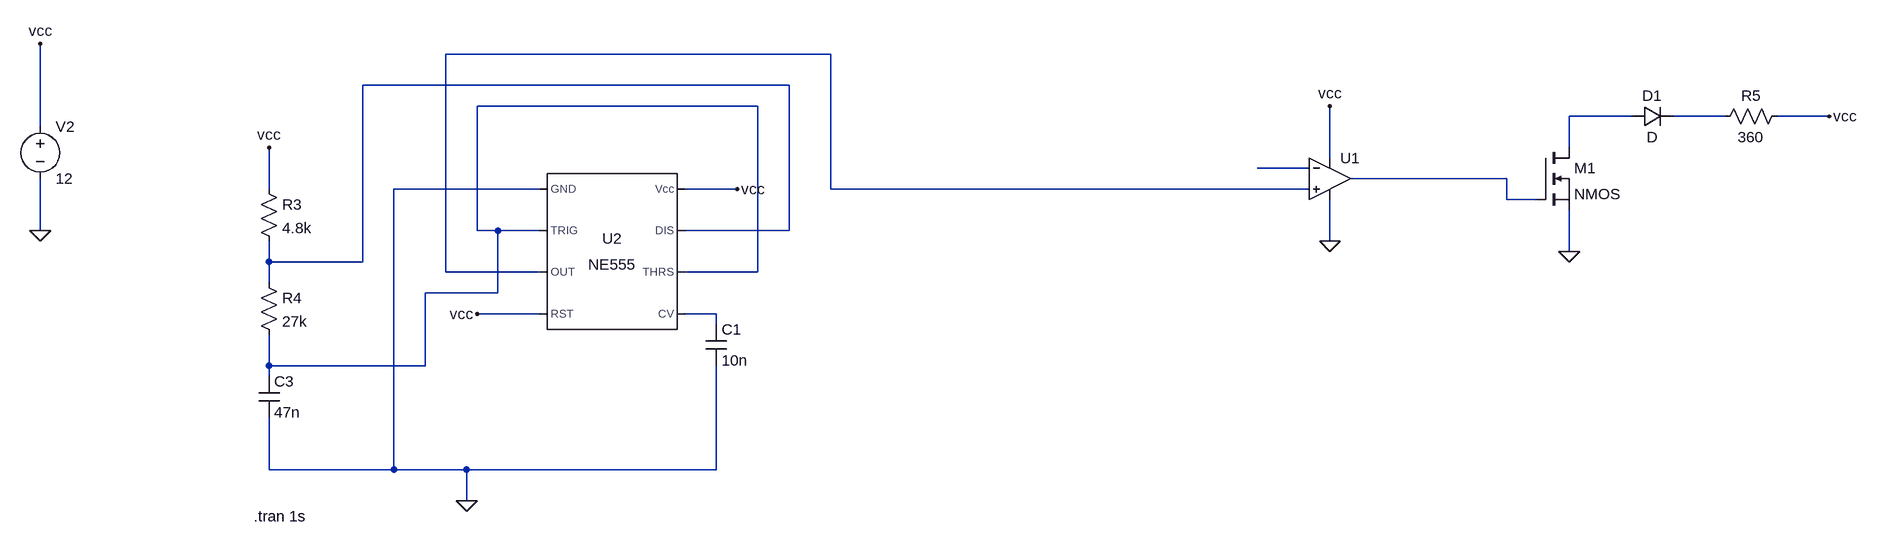
[diagram p0: schematic Pulse_Width_Modulator.asc]
Pulse_Width_Modulator.asc, the LTspice schematic file:
Version 4
SHEET 1 1144 680
WIRE -448 -48 -1040 -48
WIRE -512 0 -1168 0
WIRE -560 32 -992 32
WIRE 784 48 688 48
WIRE 928 48 848 48
WIRE 1088 48 1008 48
WIRE -1664 64 -1664 -64
WIRE 688 96 688 48
WIRE 320 112 320 32
WIRE 288 128 208 128
WIRE 592 144 352 144
WIRE -1312 160 -1312 96
WIRE -896 160 -1120 160
WIRE -592 160 -672 160
WIRE -448 160 -448 -48
WIRE 288 160 -448 160
WIRE 592 176 592 144
WIRE 640 176 592 176
WIRE -1664 224 -1664 144
WIRE -992 224 -992 32
WIRE -960 224 -992 224
WIRE -896 224 -960 224
WIRE -512 224 -512 0
WIRE -512 224 -672 224
WIRE 320 240 320 176
WIRE 688 256 688 192
WIRE -1312 272 -1312 240
WIRE -1168 272 -1168 0
WIRE -1168 272 -1312 272
WIRE -1040 288 -1040 -48
WIRE -896 288 -1040 288
WIRE -560 288 -560 32
WIRE -560 288 -672 288
WIRE -1312 304 -1312 272
WIRE -960 320 -960 224
WIRE -960 320 -1072 320
WIRE -896 352 -992 352
WIRE -624 352 -672 352
WIRE -624 368 -624 352
WIRE -1312 432 -1312 384
WIRE -1072 432 -1072 320
WIRE -1072 432 -1312 432
WIRE -1312 448 -1312 432
WIRE -1312 592 -1312 512
WIRE -1120 592 -1120 160
WIRE -1120 592 -1312 592
WIRE -1008 592 -1120 592
WIRE -624 592 -624 432
WIRE -624 592 -1008 592
WIRE -1008 640 -1008 592
FLAG 320 240 0
FLAG 320 32 vcc
FLAG -992 352 vcc
FLAG -592 160 vcc
FLAG -1312 96 vcc
FLAG -1008 640 0
FLAG -1664 224 0
FLAG -1664 -64 vcc
FLAG 688 256 0
FLAG 1088 48 vcc
SYMBOL OpAmps\\UniversalOpAmp2 320 144 R0
SYMATTR InstName U1
SYMBOL Misc\\NE555 -784 256 R0
SYMATTR InstName U2
SYMBOL cap -640 368 R0
SYMATTR InstName C1
SYMATTR Value 10n
SYMBOL res -1328 144 R0
SYMATTR InstName R3
SYMATTR Value 4.8k
SYMBOL res -1328 288 R0
SYMATTR InstName R4
SYMATTR Value 27k
SYMBOL cap -1328 448 R0
SYMATTR InstName C3
SYMATTR Value 47n
SYMBOL voltage -1664 48 R0
SYMATTR InstName V2
SYMATTR Value 12
SYMBOL nmos 640 96 R0
SYMATTR InstName M1
SYMBOL diode 784 64 R270
WINDOW 0 32 32 VTop 2
WINDOW 3 0 32 VBottom 2
SYMATTR InstName D1
SYMBOL res 1024 32 R90
WINDOW 0 0 56 VBottom 2
WINDOW 3 32 56 VTop 2
SYMATTR InstName R5
SYMATTR Value 360
TEXT -1336 664 Left 2 !.tran 1s

The netlist it stands for:
* Pulse_Width_Modulator.asc
XU1 N001 N006 vcc 0 N007 level2 Avol=1Meg GBW=10Meg Slew=10Meg Ilimit=25m Rail=0 Vos=0 En=0 Enk=0 In=0 Ink=0 Rin=500Meg  ; pins In+ In- V+ V- OUT
XU2 0 N003 N001 vcc N008 N003 N002 vcc NE555  ; pins GND TRIG OUT RST CV THRS DIS Vcc
C1 N008 0 10n
R3 vcc N002 4.8k
R4 N002 N003 27k
C3 N003 0 47n
V2 vcc 0 12
M1 N004 N007 0 0 NMOS
D1 N004 N005 D
R5 vcc N005 360
.model D D
.lib standard.dio
.model NMOS NMOS
.model PMOS PMOS
.lib standard.mos
.tran 1s
.lib UniversalOpAmp2.lib
.lib NE555.sub
.backanno
.end